# EAGLE design Proyecto (EAGLE 9.6.2)
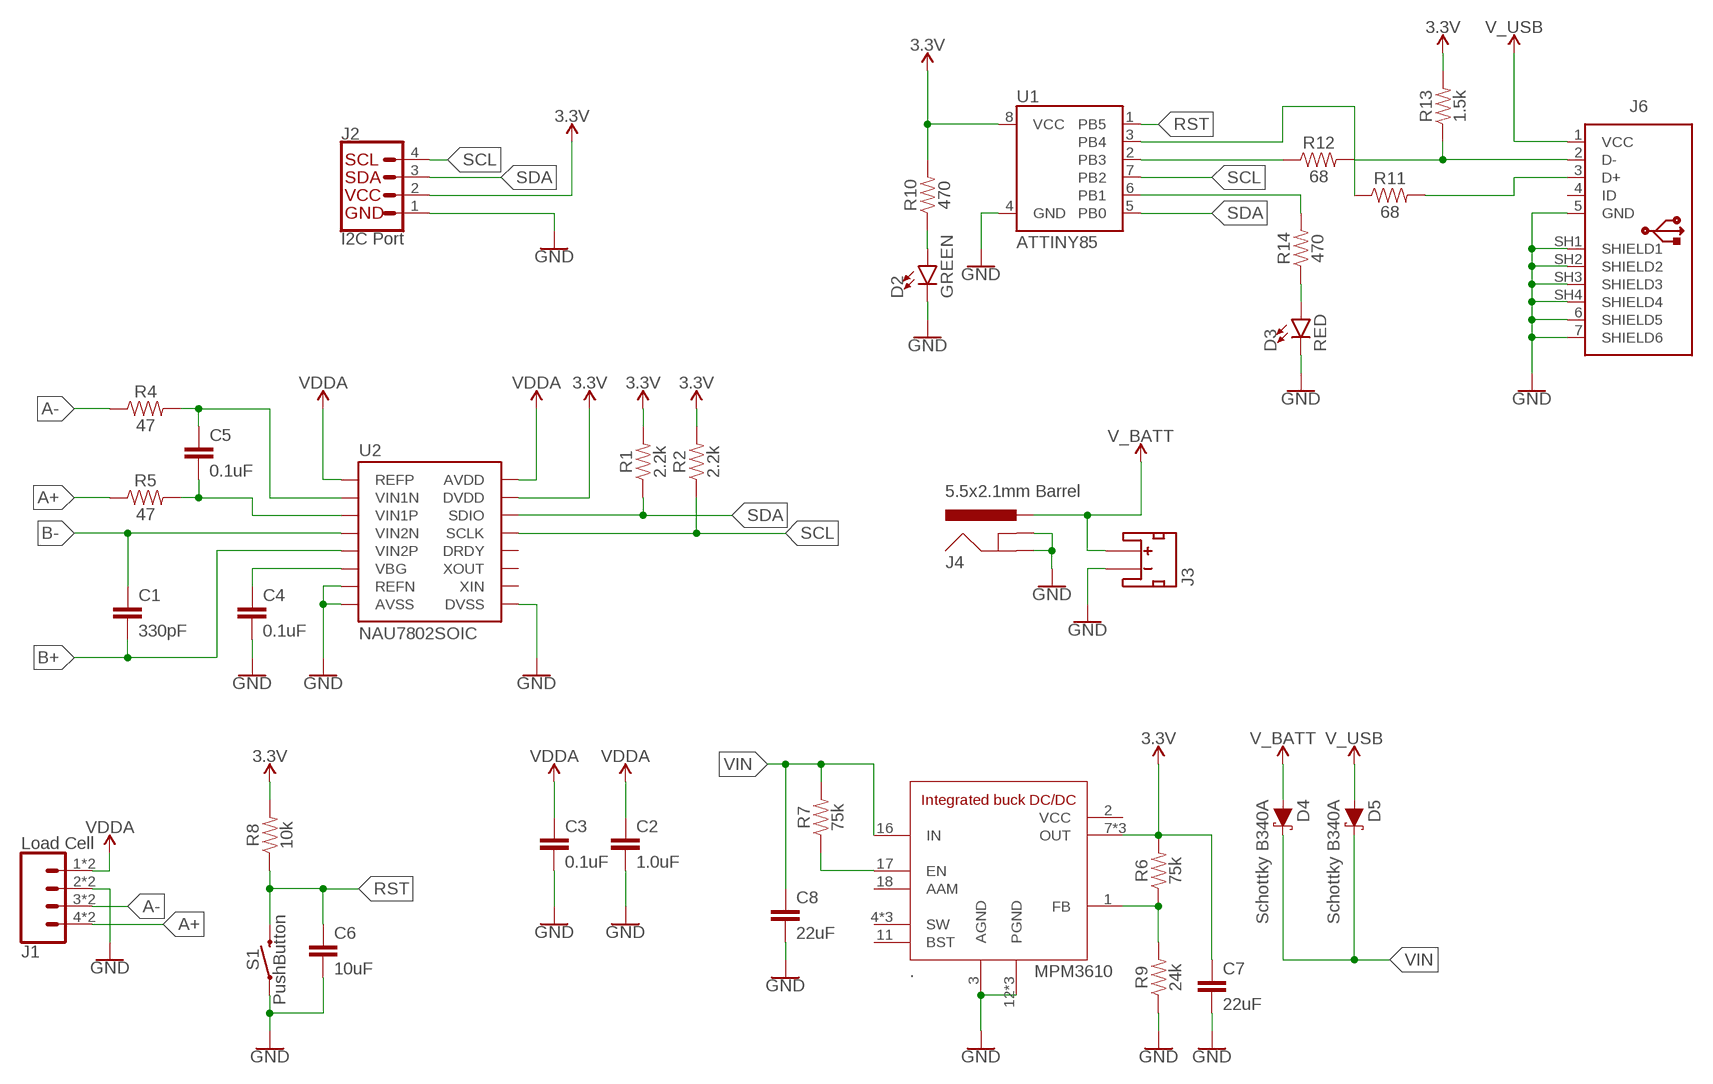
[diagram p0: schematic, sheet 1]

## Parts
.  MPM3610  MICROBUILDER_MPM3610  [MICROBUILDER_MPM3610]
C1  330pF  330PF-0603-50V-5%  [0603]
C2  1.0uF  1.0UF-0603-16V-10%  [0603]
C3  0.1uF  0.1UF-0603-25V-5%  [0603]
C4  0.1uF  0.1UF-0603-25V-5%  [0603]
C5  0.1uF  0.1UF-0603-25V-5%  [0603]
C6  10uF  10UF-0603-6.3V-20%  [0603]
C7  22uF  22UF-1206-50V-10%  [1206]
C8  22uF  22UF-1206-50V-10%  [1206]
D2  GREEN  LED-GREEN0603  [LED-0603]
D3  RED  LED-RED0603  [LED-0603]
D4  Schottky B340A  DIODE-SCHOTTKY-B340A  [SMA-DIODE]
D5  Schottky B340A  DIODE-SCHOTTKY-B340A  [SMA-DIODE]
J1  Load Cell  CONN_04SPRING  [1X04_SPRING_TERMINAL]
J2  I2C Port  QWIIC_CONNECTOR  [JST04_1MM_VERT]
J3  JST_2MM_MALE  [JST-2-SMD]
J4  5.5x2.1mm Barrel  POWER_JACKSMD  [POWER_JACK_SMD]
J6  10103594  [10103594]
R1  2.2k  2.2KOHM-0603-1/10W-1%  [0603]
R2  2.2k  2.2KOHM-0603-1/10W-1%  [0603]
R4  47  47OHM-0603-1/10W-1%  [0603]
R5  47  47OHM-0603-1/10W-1%  [0603]
R6  75k  75KOHM-0603-1/10W-1%  [0603]
R7  75k  75KOHM-0603-1/10W-1%  [0603]
R8  10k  10KOHM-0603-1/10W-1%  [0603]
R9  24k  20KOHM-0603-1/10W-1%  [0603]
R10  470  47OHM-0603-1/10W-1%  [0603]
R11  68  68OHM-0603-1/10W-1%  [0603]
R12  68  68OHM-0603-1/10W-1%  [0603]
R13  1.5k  1.5KOHM-0603-1/10W-1%  [0603]
R14  470  47OHM-0603-1/10W-1%  [0603]
S1  PushButton  MOMENTARY-SWITCH-SPST-SMD-5.2-TALL-REDUNDANT  [TACTILE_SWITCH_SMD_5.2MM]
U1  ATTINY85  [ATTINY85]
U2  NAU7802SOIC  [SO16]

## Nets
3.3V: ..7(OUT) ..8(OUT) ..9(OUT) C7.1 J2.2 R1.2 R2.2 R6.2 R8.2 R10.2 R13.2 U1.8(VCC) U2.15(DVDD)
A+: J1.4 J1.8 R5.1
A-: J1.3 J1.7 R4.1
B+: C1.2 U2.5(VIN2P)
B-: C1.1 U2.4(VIN2N)
GND: ..3(AGND) ..12(PGND) ..13(PGND) ..14(PGND) C2.2 C3.2 C4.2 C6.2 C7.2 C8.2 D2.C D3.C J1.2 J1.6 J2.1 J3.1(-) J4.GND(GNDBREAK) J4.P$4(GND) R9.1 S1.1 S1.2 U1.4(GND) U2.7(REFN) U2.8(AVSS) U2.9(DVSS)
N$1: R11.1 U1.3(PB4)
N$2: C4.1 U2.6(VBG)
N$3: ..1(FB) R6.1 R9.2
N$4: D3.A R14.1
N$5: C5.1 R4.2 U2.2(VIN1N)
N$6: C5.2 R5.2 U2.3(VIN1P)
N$7: ..17(EN) R7.1
N$8: R14.2 U1.6(PB1)
N$9: J6.3(D+) R11.2
N$10: R12.1 U1.2(PB3)
N$11: J6.2(D-) R12.2 R13.1
N$13: D2.A R10.1
RST: C6.1 R8.1 S1.3 S1.4 U1.1(PB5)
SCL: J2.4 R2.1 U1.7(PB2) U2.13(SCLK)
SDA: J2.3 R1.1 U1.5(PB0) U2.14(SDIO)
SHIELD5: J6.5(GND) J6.6(SHIELD5) J6.7(SHIELD6) J6.SH1(SHIELD1) J6.SH2(SHIELD2) J6.SH3(SHIELD3) J6.SH4(SHIELD4) ; supply symbol labelled GND
V_BATT: D4.A J3.2(+) J4.VIN0(PWR)
V_USB: D5.A J6.1(VCC)
VDDA: C2.1 C3.1 J1.1 J1.5 U2.1(REFP) U2.16(AVDD)
VIN: ..16(IN) C8.1 D4.C D5.C R7.2
Unconnected: ..4(SW) ..5(SW) ..6(SW) ..11(BST) ..18(AAM) J3.NC1(PAD1) J3.NC2(PAD2) J6.4(ID) U2.10(XIN) U2.11(XOUT) U2.12(DRDY)

## Power pins joined to a net without a drawn wire
VCC: ..2(VCC)

## Library data of the parts
. = Adafruit MPM3610:MICROBUILDER_MPM3610
C1 = SparkFun-Capacitors:330PF: 330pF/0.33nF ceramic capacitors A capacitor is a passive two-terminal electrical component used to store electrical energy temporarily in an electric field.; PROD_ID: CAP-10108
C2 = SparkFun-Capacitors:1.0UF: 1µF ceramic capacitors A capacitor is a passive two-terminal electrical component used to store electrical energy temporarily in an electric field.; PROD_ID: CAP-00868
C3-C5 = SparkFun-Capacitors:0.1UF: 0.1µF ceramic capacitors A capacitor is a passive two-terminal electrical component used to store electrical energy temporarily in an electric field.; PROD_ID: CAP-08604
C6 = SparkFun-Capacitors:10UF: 10.0µF ceramic capacitors A capacitor is a passive two-terminal electrical component used to store electrical energy temporarily in an electric field.; PROD_ID: CAP-11015
C7 C8 = SparkFun-Capacitors:22UF: 22µF ceramic capacitors A capacitor is a passive two-terminal electrical component used to store electrical energy temporarily in an electric field.; PROD_ID: CAP-15263
D2 = SparkFun-LED:LED-GREEN: Green SMD LED Used in manufacturing of various products at SparkFun Packages: 0603 - SMD 0603 package [Product Link] <http://www.futureelectronics.com/en/technologies/semiconductors/optoelectronics/leds/Pages/9894312-LTST-C190GKT.aspx?CrossPart=HSMG-C190&IM=0> LilyPad 1206 - SMD1206 LilyPad package [Product Link] <http://www.futureelectronics.com/en/Technologies/Product.aspx?ProductID=IN150NGHARVATEKCORPORATION2049943&IM=0> 1206 - SMD1206 package [Product Link] <http://www.futureelectronics.com/en/technologies/semiconductors/optoelectronics/leds/Pages/8315665-LTST-C150KGKT.aspx?IM=0> 1206 Bottom Mount -SMD 1206 Bottom Mount [Product Link] <http://www.digikey.com/product-detail/en/lite-on-inc/LTST-C230KGKT/160-1456-1-ND/386854> SparkFun Products: Pro Mini 328 -5V <https://www.sparkfun.com/products/821> RedBoard <https://www.sparkfun.com/products/12757> MP3 Trigger <https://www.sparkfun.com/products/13720> Makey Makey <https://www.sparkfun.com/products/11076>; PROD_ID: DIO-00821
D3 = SparkFun-LED:LED-RED: Red SMD LED Used in manufacturing of most products at SparkFun Packages: 0603 - SMD 0603 package [Product Link] <http://docs.avagotech.com/docs/AV02-0551EN> 0603 SMART - SMD 0603 SMART package ( more efficient and expensive)[Product Link] <http://www.osram-os.com/Graphics/XPic2/00077099_0.pdf> 1206 - SMD1206 package [Product Link] <https://www.sparkfun.com/datasheets/DevTools/LilyPad/Q150OVS4.pdff> SparkFun Products: Pro Mini 328 -5V <https://www.sparkfun.com/products/821> RedBoard <https://www.sparkfun.com/products/12757> IOIO-OTG <https://www.sparkfun.com/products/13613>; PROD_ID: DIO-00819
D4 D5 = SparkFun-DiscreteSemi:DIODE-SCHOTTKY: Schottky diode A Schottky diode is a semiconductor diode which has a low forward voltage drop and a very fast switching action.; PROD_ID: DIO-09886; VALUE: 3A/40V/500mV
J1 = SparkFun-Connectors:CONN_04: Multi connection point. Often used as Generic Header-pin footprint for 0.1 inch spaced/style header connections On any of the 0.1 inch spaced packages, you can populate with these: Break Away Headers - Straight <https://www.sparkfun.com/products/116> (PRT-00116) Break Away Male Headers - Right Angle <https://www.sparkfun.com/products/553> (PRT-00553) Female Headers <https://www.sparkfun.com/products/115> (PRT-00115) Break Away Headers - Machine Pin <https://www.sparkfun.com/products/117> (PRT-00117) Break Away Female Headers - Swiss Machine Pin <https://www.sparkfun.com/products/743> (PRT-00743) For SCREWTERMINALS and SPRING TERMINALS visit here: Screw Terimnals on SparkFun.com <https://www.sparkfun.com/search/results?term=Screw+Terminals> (5mm/3.5mm/2.54mm spacing) This device is also useful as a general connection point to wire up your design to another part of your project. Our various solder wires solder well into these plated through hole pads. Hook-Up Wire - Assortment (Stranded, 22 AWG) <https://www.sparkfun.com/products/11375> (PRT-11375) Hook-Up Wire - Assortment (Solid Core, 22 AWG) <https://www.sparkfun.com/products/11367> (PRT-11367) View the entire wire category on our website here <https://www.sparkfun.com/categories/141> Special notes: Molex polarized connector foot print use with SKU : PRT-08231 with associated crimp pins and housings. 1MM SMD Version SKU: PRT-10208; PROD_ID: CONN-14363; SF_ID: PRT-08075
J2 = SparkFun-Connectors:QWIIC_CONNECTOR: SparkFun I2C Standard Qwiic Connector An SMD 1mm pitch JST connector makes it easy and quick (get it? Qwiic?) to connect I2C devices to each other. The Qwiic system <http://www.sparkfun.com/qwiic> enables fast and solderless connection between popular platforms and various sensors and actuators. We carry 200mm <https://www.sparkfun.com/products/14204>, 100mm <https://www.sparkfun.com/products/14205>, 50mm <https://www.sparkfun.com/products/14206>, and breadboard friendly <https://www.sparkfun.com/products/14207> Qwiic cables. We also offer 10 pcs strips <https://www.sparkfun.com/products/14323> the SMD connectors.; PROD_ID: CONN-14483; VALUE: Vertical Qwiic Connector
J3 = SparkFun-Connectors:JST_2MM_MALE: JST 2MM MALE RA CONNECTOR Two pin, compact surface mount connector. Commonly used as a battery input connection point. We really like the solid locking feeling and high current rating on these small connectors. We use these all the time as battery connectors. Mates to single-cell LiPo batteries. Here is the connector we sell at SparkFun: JST Right Angle Connector - White <https://www.sparkfun.com/products/8612> (PRT-08612) Datasheet <http://www.sparkfun.com/datasheets/Prototyping/Connectors/JST-Horizontal.pdf> It was used on these SparkFun products: SparkFun MOSFET Power Controller <https://www.sparkfun.com/products/11214> (PRT-11214) SparkFun Battery Babysitter - LiPo Battery Manager <https://www.sparkfun.com/products/13777> (PRT-13777) And many, many others that required a lipo battery connection.; PROD_ID: CONN-11443; SF_ID: PRT-08612
J4 = SparkFun-Connectors:POWER_JACK: Power Jack Connector This is the standard 5.5mm barrel jack for power. The PTH is the most common, proven, reliable, footprint. The Slot footprint only works if the mill layer is transmitted to the PCB fab house so be warned. Here are the connectors we sell at SparkFun: DC Barrel Power Jack/Connector <https://www.sparkfun.com/products/119> (PRT-00119) DC Barrel Power Jack/Connector (SMD) <https://www.sparkfun.com/products/12748> (PRT-12748) DC Barrel Jack Adapter - Breadboard Compatible <https://www.sparkfun.com/products/10811> (PRT-10811) It is used on this SparkFun product (and many, many others): SparkFun RedBoard - Programmed with Arduino <https://www.sparkfun.com/products/12757> (DEV-12757) Also, if you need a mating power supply or connector, please check these out: Wall Adapter Power Supply - 9VDC 650mA <https://www.sparkfun.com/products/298> (TOL-00298) DC Barrel Jack Adapter - Male <https://www.sparkfun.com/products/10287> (PRT-10287); PROD_ID: CONN-08106; SF_ID: PRT-12748
J6 = Connector_USB:10103594: USB(2.0) Micro-B, RCPT, 5POS, SMD-THT-R/A Datasheet <https://cdn.amphenol-icc.com/media/wysiwyg/files/documentation/datasheet/inputoutput/io_usb_micro.pdf> Drawing <https://cdn.amphenol-icc.com/media/wysiwyg/files/drawing/10103594.pdf>; CATEGORY: Connectors; CONTACTS: 5; CURRENT-RATING: 1.8A; DESCRIPTION: CONN RCPT USB2.0 MICRO B SMD R/A; GENDER: Receptacle; MANUFACTURER: Amphenol ICC (FCI); MOUNT_TYPE: R/A; MPN: 10103594-0001LF; OPERATING_TEMPERATURE: -30°C ~ 80°C; PART_STATUS: ACTIVE; ROHS_COMPLIANT: COMPLIANT; SUB_CATEGORY: USB; TYPE: USB-micro B; VOLTAGE-RATING: 100VAC
R1 R2 = SparkFun-Resistors:2.2KOHM: 2.2kΩ resistor A resistor is a passive two-terminal electrical component that implements electrical resistance as a circuit element. Resistors act to reduce current flow, and, at the same time, act to lower voltage levels within circuits. - Wikipedia; PROD_ID: RES-08272
R4 R5 = SparkFun-Resistors:47OHM: 47Ω resistor A resistor is a passive two-terminal electrical component that implements electrical resistance as a circuit element. Resistors act to reduce current flow, and, at the same time, act to lower voltage levels within circuits. - Wikipedia; PROD_ID: RES-14282
R6 R7 = SparkFun-Resistors:75KOHM: 75kΩ resistor A resistor is a passive two-terminal electrical component that implements electrical resistance as a circuit element. Resistors act to reduce current flow, and, at the same time, act to lower voltage levels within circuits. - Wikipedia; PROD_ID: RES-09737
R8 = SparkFun-Resistors:10KOHM: 10kΩ resistor A resistor is a passive two-terminal electrical component that implements electrical resistance as a circuit element. Resistors act to reduce current flow, and, at the same time, act to lower voltage levels within circuits. - Wikipedia; PROD_ID: RES-00824
R9 = SparkFun-Resistors:20KOHM: 20kΩ resistor A resistor is a passive two-terminal electrical component that implements electrical resistance as a circuit element. Resistors act to reduce current flow, and, at the same time, act to lower voltage levels within circuits. - Wikipedia; PROD_ID: RES-09383; VALUE: 20k
R10 R14 = SparkFun-Resistors:47OHM: 47Ω resistor A resistor is a passive two-terminal electrical component that implements electrical resistance as a circuit element. Resistors act to reduce current flow, and, at the same time, act to lower voltage levels within circuits. - Wikipedia; PROD_ID: RES-14282; VALUE: 47
R11 R12 = SparkFun-Resistors:68OHM: 68Ω resistor A resistor is a passive two-terminal electrical component that implements electrical resistance as a circuit element. Resistors act to reduce current flow, and, at the same time, act to lower voltage levels within circuits. - Wikipedia
R13 = SparkFun-Resistors:1.5KOHM: 1.5kΩ resistor A resistor is a passive two-terminal electrical component that implements electrical resistance as a circuit element. Resistors act to reduce current flow, and, at the same time, act to lower voltage levels within circuits. - Wikipedia; PROD_ID: RES-08306
S1 = SparkFun-Switches:MOMENTARY-SWITCH-SPST: Momentary Switch (Pushbutton) - SPST Normally-open (NO) SPST momentary switches (buttons, pushbuttons). Variants PTH-12MM - 12mm square, through-hole Momentary Pushbutton Switch - 12mm Square <https://www.sparkfun.com/products/9190> (COM-09190) PTH-6.0MM, PTH-6.0MM-KIT - 6.0mm square, through-hole Mini Pushbutton Switch <https://www.sparkfun.com/products/97> (COM-00097) KIT package intended for soldering kit's - only one side of pads' copper is exposed. PTH-RIGHT-ANGLE-KIT - Right-angle, through-hole Right Angle Tactile Button <https://www.sparkfun.com/products/10791> - Used on SparkFun BigTime Watch Kit <https://www.sparkfun.com/products/11734> SMD-12MM - 12mm square, surface-mount Tactile Button - SMD (12mm) <https://www.sparkfun.com/products/12993> (COM-12993) Used on SparkFun PicoBoard <https://www.sparkfun.com/products/11888> SMD-4.5MM - 4.5mm Square Trackball Switch Used on SparkFun Blackberry Trackballer Breakout <https://www.sparkfun.com/products/13169> SMD-4.6MMX2.8MM - 4.60mm x 2.80mm, surface mount Used on SparkFun Pro Micro - RP2040 <https://www.sparkfun.com/products/17717> SMD-5.2MM, SMD-5.2-REDUNDANT - 5.2mm square, surface-mount Mini Pushbutton Switch - SMD <https://www.sparkfun.com/products/8720> (COM-08720) Used on Arduino Pro Mini <https://www.sparkfun.com/products/11114> REDUNDANT package connects both switch circuits together SMD-6.0X3.5MM - 6.0 x 3.5mm, surface mount Momentary Reset Switch SMD <https://www.sparkfun.com/products/8229> (COM-08229) SMD-6.2MM-TALL - 6.2mm square, surface mount Tactile Button - SMD (6mm) <https://www.sparkfun.com/products/12992> Used on SparkFun Digital Sandbox <https://www.sparkfun.com/products/12651> SMD-RIGHT-ANGLE - Right-angle, surface mount Used on SparkFun Block for Intel® Edison - Arduino <https://www.sparkfun.com/products/13036>; PROD_ID: SWCH-14139
U1 = SparkFun-IC-Microcontroller:ATTINY85; PROD_ID: IC-09092
U2 = SparkFun-IC-Conversion:NAU7802: 24-bit load cell conversion IC with I2C interface in SOIC-16 package. Similar to HX711 but with true I2C interface.; PROD_ID: IC-14299

## Net classes
0 Voltage: width 0.391 mm

## Board
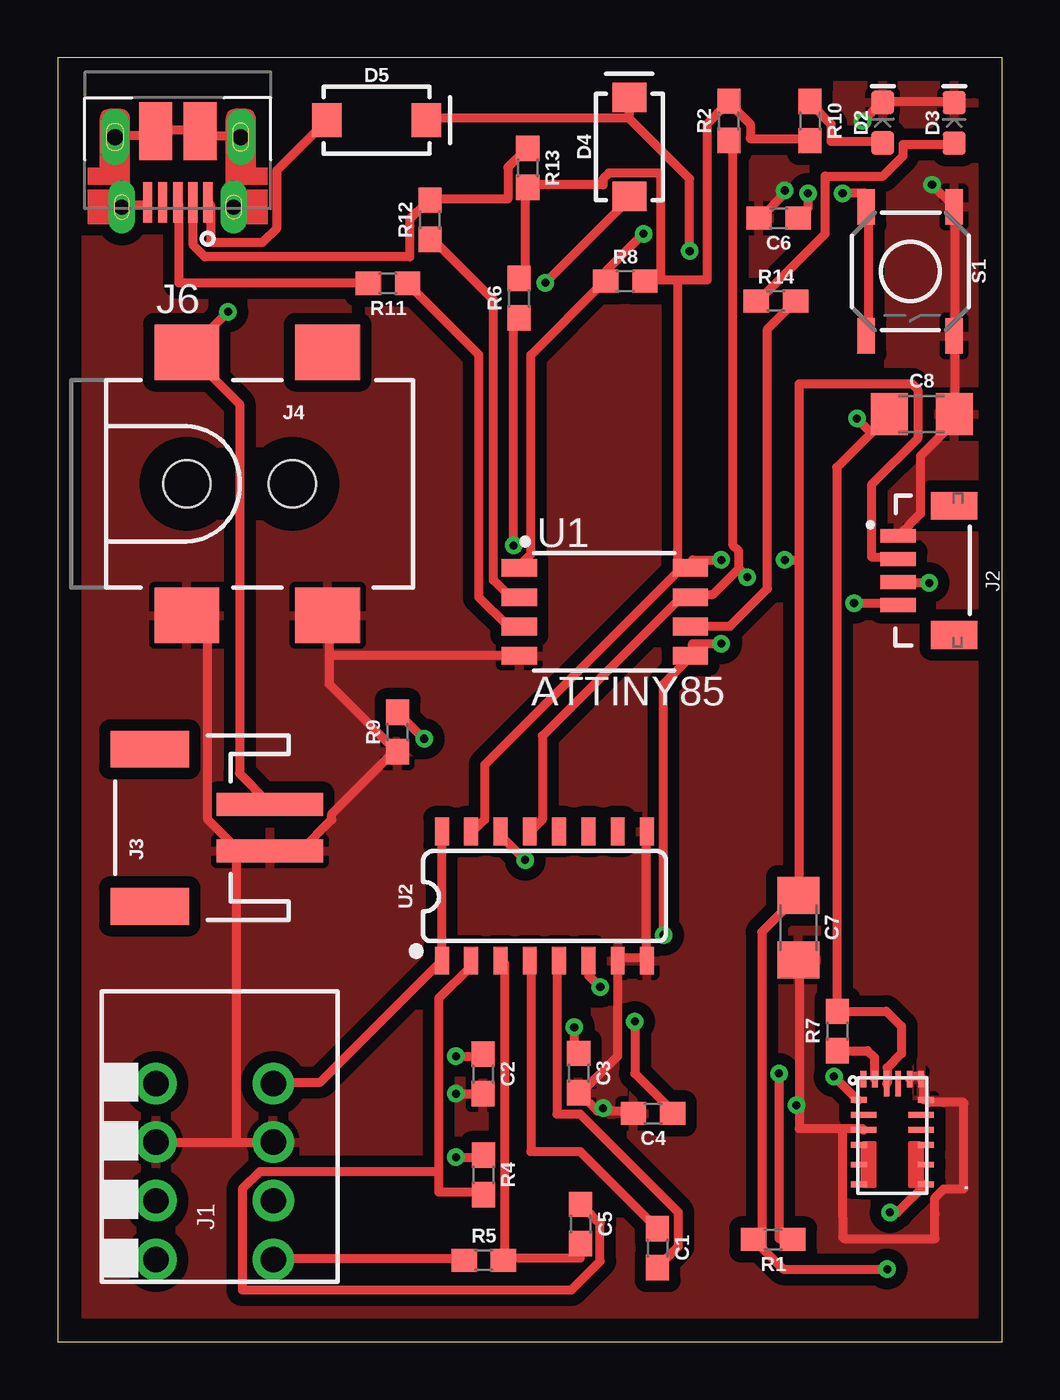
[diagram p1: board, top side]
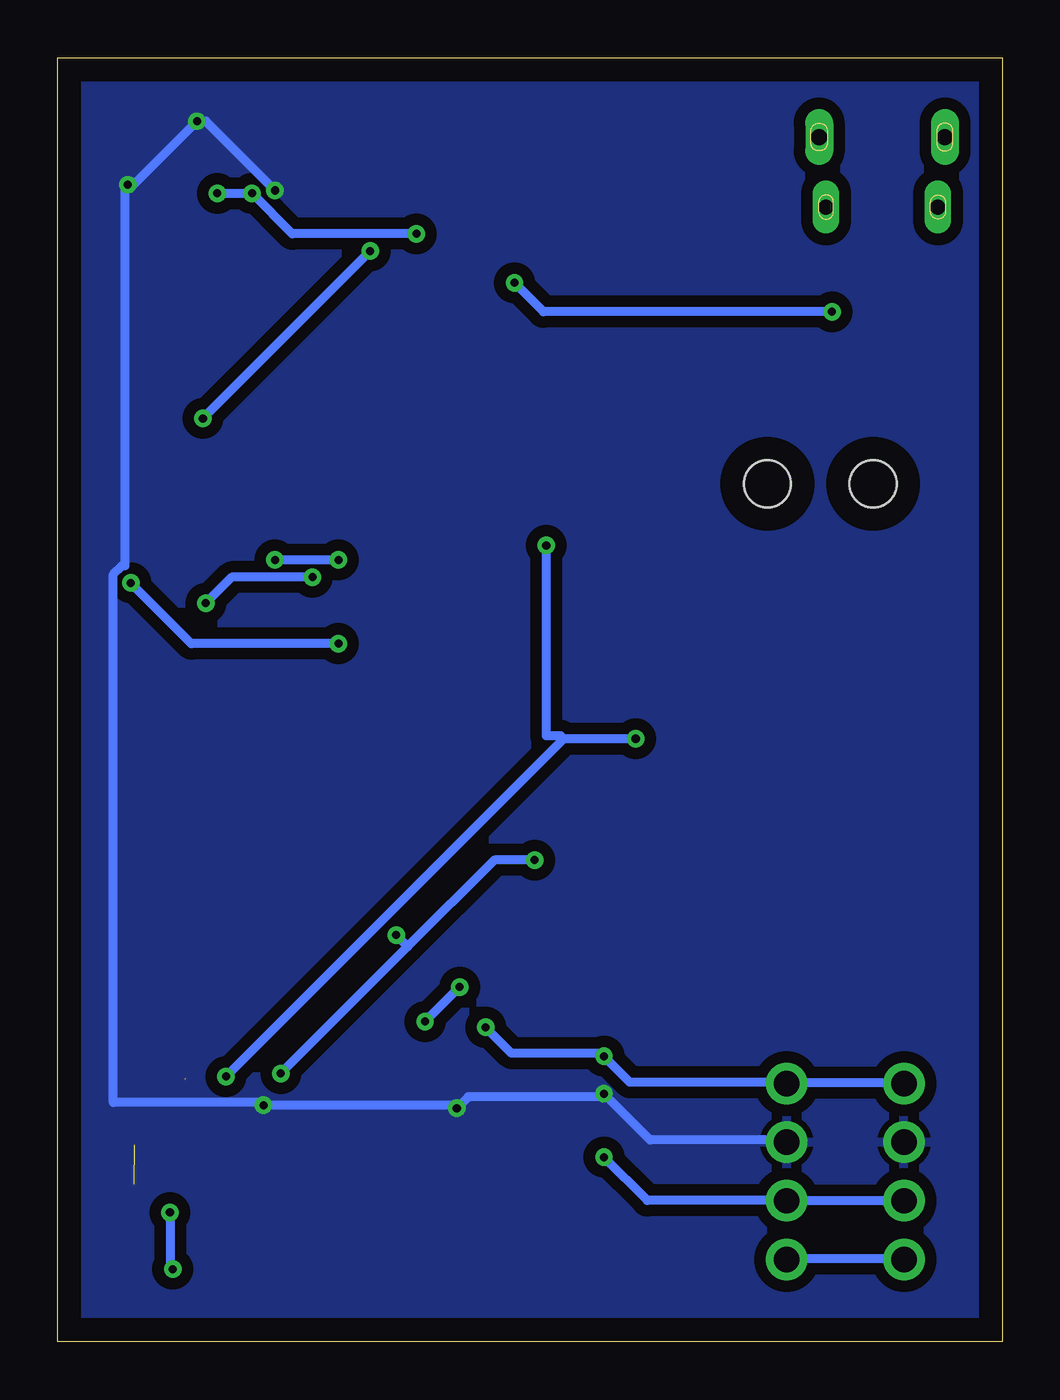
[diagram p2: board, bottom side, seen from below]

Size 40.91 x 55.62 mm. Coordinates in mm from the lower left corner, seen from the top.
Outline: 0,0 40.91,0 40.91,55.62 0,55.62 0,0
Copper layers (1*16): Top 0.035mm / dielectric 1.5mm / Bottom 0.035mm
Design rules "default": minimum track width 6mil, minimum drill 0.35mm, track to track 6mil, track to pad 6mil, pad to pad 6mil, via to via 6mil, smd to smd 6mil, copper to edge 40mil, drill to drill 6mil, minimum pad ring 10mil, minimum via ring 8mil, stop-mask expansion 4mil, vias tented up to drill 0mil, thermal gap 10mil

### Footprints (pad centres in the part's own frame; a part is rotated, then mirrored left to right if it is on the bottom)
MICROBUILDER_MPM3610 = smd 0.7 x 0.25: 1 -1.45,1.55; 4 -1.45,-0.4; 5 -1.45,-1.25; 6 -1.45,-2.1; 7 1.45,-2.1; 8 1.45,-1.25; 9 1.45,-0.4; 12 1.45,1.55 | smd 1.1 x 0.25: 2 -1.25,0.9; 3 -1.25,0.25; 10 1.25,0.25; 11 1.25,0.9 | smd 0.25 x 0.7: 13 1.25,2.45; 14 0.75,2.45; 17 -0.75,2.45; 18 -1.25,2.45 | smd 0.25 x 1.1: 15 0.25,2.25; 16 -0.25,2.25
0603 = smd 1.1 x 1: 1 -0.85,0; 2 0.85,0
1206 = smd 1.6 x 1.8: 1 -1.4,0; 2 1.4,0
LED-0603 = smd 1 x 1: A -0.877,0; C 0.877,0
SMA-DIODE = smd 1.27 x 1.47: A -2.15,0; C 2.15,0
1X04_SPRING_TERMINAL = drill 1.1 pad 1.8: 1 7.62,2.54; 2 5.08,2.54; 3 2.54,2.54; 4 0,2.54; 5 7.62,-2.54; 6 5.08,-2.54; 7 2.54,-2.54; 8 0,-2.54
JST04_1MM_VERT = smd 0.6 x 1.55: 1 -1.478,0.775; 2 -0.478,0.775; 3 0.522,0.775; 4 1.522,0.775 | smd 1.2 x 2: NC1 -2.778,3.2; NC2 2.822,3.2
JST-2-SMD = smd 1 x 4.6: 1 -1,-3.7; 2 1,-3.7 | smd 1.6 x 3.4: NC1 -3.4,1.5; NC2 3.4,1.5
POWER_JACK_SMD = smd 2.8 x 2.4: GND 0,-5.7; P$4 6.1,-5.7; VIN0 0,5.7; VIN1 6.1,5.7 | hole 2.032: 0,0; 4.572,0
10103594 = smd 0.4 x 1.75: 1 -1.3,2.825; 2 -0.65,2.825; 3 0,2.825; 4 0.65,2.825; 5 1.3,2.825 | smd 1.425 x 2.5: 6 -0.963,-0.25; 7 0.963,-0.25 | drill 0.65 pad 0.73 long: SH1 -2.425,3.03; SH2 2.425,3.03 | drill 0.7 long: SH3 -2.725,0; SH4 2.725,0
TACTILE_SWITCH_SMD_5.2MM = smd 1.524 x 0.762: 1 -2.794,1.905; 2 2.794,1.905; 3 -2.794,-1.905; 4 2.794,-1.905
ATTINY85 = smd 1.524 x 0.762: 1 -3.683,1.905; 2 -3.683,0.635; 3 -3.683,-0.635; 4 -3.683,-1.905; 5 3.727,-1.905; 6 3.727,-0.635; 7 3.727,0.635; 8 3.727,1.905
SO16 = smd 0.6 x 1.2: 1 -4.445,-2.8; 2 -3.175,-2.8; 3 -1.905,-2.8; 4 -0.635,-2.8; 5 0.635,-2.8; 6 1.905,-2.8; 7 3.175,-2.8; 8 4.445,-2.8; 9 4.445,2.8; 10 3.175,2.8; 11 1.905,2.8; 12 0.635,2.8; 13 -0.635,2.8; 14 -1.905,2.8; 15 -3.175,2.8; 16 -4.445,2.8

### Placement (x,y rotation side)
.  36.15,8.93 0 top
C1  25.98,4.06 270 top
C2  18.43,11.6 270 top
C3  22.57,11.64 270 top
C4  25.79,9.89 180 top
C5  22.65,5.11 270 top
C6  31.23,48.67 180 top
C7  32.09,17.94 270 top
C8  37.43,40.18 0 top
D2  35.73,52.8 90 top
D3  38.84,52.8 90 top
D4  24.76,51.75 90 top
D5  13.81,52.91 0 top
J1  6.8,3.57 90 top
J2  35.63,33.43 270 top
J3  5.49,22.27 90 top
J4  5.59,37.16 0 top
J6  5.2,52.18 180 top
R1  30.99,4.43 180 top
R2  29.07,52.89 90 top
R4  18.44,7.23 270 top
R5  18.46,3.53 0 top
R6  19.99,45.2 90 top
R7  33.78,13.46 90 top
R8  24.59,45.94 0 top
R9  14.73,26.41 90 top
R10  32.59,52.87 270 top
R11  14.31,45.84 180 top
R12  16.13,48.6 90 top
R13  20.36,50.85 270 top
R14  31.11,45.07 0 top
S1  36.93,46.36 270 top
U1  23.68,31.62 0 top
U2  21.09,19.31 0 top

### Tracks (layer width: path | path; a pad name or v marks a point on that pad's centre or on a via)
3.3V  (via drill 0.35)  (2 unrouted)
  Top 0.391: 32.12,33.87 32.12,19.49 C7.1 32,19.24 30.5,17.74 30.5,4.46 R1.2 31.43,3.14 v35.93,3.14 | 32.12,33.87 32.12,41.49 37,41.49 37.25,41.24 37.25,39.12 35.25,37.12 35.25,33.99 36.38,33.99 J2.2 | R6.2 20,46.12 20.25,46.37 20.25,49.99 R13.2 20.5,50.12 23.62,50.12 23.62,50.37 23.88,50.62 26.12,50.62 26.12,45.99 | 26.88,45.99 28.12,45.99 28.12,52.74 29,53.62 R2.2 29.12,53.62 30,52.74 30,52.12 32.5,52.12 R10.2 | 26.88,45.99 26.12,45.99 | 26.12,45.99 25.5,45.99 R8.2 | U2.15 18,22.12 18.5,22.62 18.5,24.99 27,33.49 27.38,33.49 U1.8 | 26.88,45.99 26.88,33.62 U1.8 | v31.5,33.87 32.12,33.87 | v28.75,33.87 27.5,33.87 27.5,33.62 U1.8 | ..7 36.38,5.6 v36.05,5.6
  Bottom 0.391: v28.75,33.87 v31.5,33.87 | v36.05,5.6 36.05,3.26 v35.93,3.14
A+
  Top 0.391: R5.1 17.5,3.62 9.38,3.62 J1.8
  Bottom 0.391: J1.4 4.38,3.62 9.25,3.62 J1.8
A-  (via drill 0.35)
  Top 0.391: v17.25,7.99 18.38,7.99 R4.1
  Bottom 0.391: v17.25,7.99 15.38,6.12 9.38,6.12 J1.7 9.25,6.12 4.38,6.12 J1.3
B+
  Top 0.391: C1.2 26,3.24 26.88,4.12 26.88,5.62 22.62,9.87 21.62,9.87 21.62,16.49 U2.5
B-
  Top 0.391: C1.1 25.88,4.99 22.62,8.24 20.5,8.24 20.5,16.49 U2.4
GND  (via drill 0.35)
  Top 0.391: 11.75,29.74 11.75,31.37 J4.P$4 | 11.75,29.74 11.75,28.49 14.62,25.62 R9.1 14.5,25.49 11.88,22.87 11.88,22.62 10.5,21.24 9.38,21.24 J3.1 | 11.75,29.74 19.88,29.74 U1.4 | J4.GND 5.62,31.37 6.5,30.49 6.5,22.62 7.75,21.37 9.12,21.37 J3.1 | D3.C 38.75,53.74 35.75,53.74 D2.C 35.62,53.62 v34.88,52.87 | v31.5,49.87 31.5,49.74 30.5,48.74 C6.2 | J2.1 36.5,34.99 37.38,35.87 37.38,38.37 38.88,39.87 38.88,39.99 C8.2 38.88,40.24 38.88,43.49 S1.2 38.88,43.74 38.88,49.12 S1.1 38.75,49.24 v37.88,50.12 | ..14 37,11.49 37.38,11.49 ..13 37.5,11.24 37.5,10.49 ..12 37.75,10.37 38.38,10.37 39.24,10.36 39.26,10.35 39.26,6.66 39.22,6.62 38.38,6.62 38,6.24 38,5.53 | 34,9.24 32.12,9.24 32.12,10.24 | 34,9.24 34.88,9.24 ..3 | 32.12,10.24 32.12,16.49 C7.2 | 38,5.53 38,4.47 37.99,4.46 34.07,4.46 34.01,4.53 34,6.24 34,9.24 | 23.62,9.99 23.38,9.99 22.62,10.74 C3.2 22.75,10.87 24.25,12.37 24.25,16.37 U2.7 24.38,16.62 25.5,16.62 U2.8 25.5,16.74 25.5,21.99 U2.9 | 23.62,9.99 24.88,9.99 C4.2 | v17.25,10.74 18.38,10.74 C2.2 | 7.75,8.62 9.25,8.62 J1.6 | 7.75,8.62 4.38,8.62 J1.2 | v23.62,10.12 23.62,9.99 | v32,10.24 32.12,10.24 | 7.75,8.62 7.75,21.24 J3.1 | 38,5.53
  Bottom 0.391: v31.5,49.87 34.5,52.87 v34.88,52.87 37.62,50.12 v37.88,50.12 38,49.99 38,33.62 38.12,33.62 38.5,33.24 38.5,10.37 32.12,10.37 v32,10.24 23.75,10.24 v23.62,10.12 23.12,10.62 17.38,10.62 v17.25,10.74 15.25,8.74 9.38,8.74 J1.6
  pour Bottom (isolate 0.5): 0,55.62 41,55.62 41,-0.38 0,-0.38
  pour Top (isolate 0.5): 0,55.62 41,55.62 41,-0.38 0,-0.38
N$1
  Top 0.391: R11.1 15.25,45.74 18.25,42.74 18.25,32.24 19.5,30.99 19.88,30.99 U1.3
N$2  (via drill 0.35)
  Top 0.391: v25,13.87 25,11.62 26.62,9.99 C4.1 | v23.5,15.37 23,15.87 23,16.49 U2.6
  Bottom 0.391: v23.5,15.37 v25,13.87
N$3  (via drill 0.35)
  Top 0.391: v33.62,11.49 34.62,10.49 ..1 | v15.88,26.12 14.75,27.24 R9.2 | v19.75,34.49 19.75,44.12 19.88,44.24 R6.1
  Bottom 0.391: 19,26.12 v33.62,11.49 | v15.88,26.12 19,26.12 | v19.75,34.49 19.75,26.24 19.12,26.24 19,26.12
N$4
  Top 0.391: D3.A 38.75,51.87 36.62,51.87 36.62,51.37 35.75,50.49 33.25,50.49 33.25,47.99 30.38,45.12 R14.1
N$5
  Top 0.391: 16.5,7.37 16.5,14.87 17.88,16.24 17.88,16.49 U2.2 | 16.5,7.37 16.5,6.49 18.38,6.49 R4.2 | 16.5,7.37 8.75,7.37 8,6.62 8,2.24 22.25,2.24 23.5,3.49 23.5,5.12 22.75,5.87 C5.1
N$6
  Top 0.391: C5.2 22.62,4.24 22.62,3.62 19.38,3.62 R5.2 19.38,3.74 19.38,16.37 19.25,16.49 U2.3
N$7  (1 unrouted)
  Top 0.391: R7.1 35.08,12.61 35.38,12.31 35.38,11.42
N$8
  Top 0.391: R14.2 31.88,44.99 30.75,43.87 30.75,32.62 29.12,30.99 27.5,30.99 U1.6
N$9
  Top 0.391: R11.2 13.38,45.87 5.25,45.87 5.25,49.24 J6.3
N$10
  Top 0.391: R12.1 16.25,47.74 18.88,45.12 18.88,32.99 19.5,32.37 19.88,32.37 U1.2
N$11
  Top 0.391: R13.1 20.25,51.62 19.5,50.87 19.5,49.49 16.25,49.49 R12.2 16,49.37 15.25,48.62 15.25,46.99 6.38,46.99 5.88,47.49 5.88,49.24 J6.2
N$13
  Top 0.391: D2.A 35.62,51.99 33.5,51.99 33.5,52.74 32.62,53.62 R10.1
RST  (via drill 0.35)
  Top 0.391: v32.5,49.74 32.5,49.12 32.12,48.74 C6.1 | v34,49.74 35,49.74 35,49.24 S1.3 35.12,48.99 35.12,43.62 S1.4 | U1.1 20,33.62 20.5,34.12 20.5,42.74 23.62,45.87 R8.1 23.75,46.12 23.75,46.37 v25.38,47.99
  Bottom 0.391: v34,49.74 v32.5,49.74 30.75,47.99 v25.38,47.99
SCL  (via drill 0.35)
  Top 0.391: 29.5,33.49 29.5,34.24 29.25,34.49 29.25,51.87 29.12,51.99 R2.1 | 29.5,33.49 28.38,32.37 27.5,32.37 U1.7 27.25,32.24 27,32.24 21,26.24 21,22.62 20.5,22.12 U2.13 | v34.5,31.99 36.38,31.99 J2.4 | 29.5,33.49 v29.88,33.12
  Bottom 0.391: v34.5,31.99 33.38,33.12 v29.88,33.12
SDA  (via drill 0.35)
  Top 0.391: v31.25,11.62 31.25,4.47 R1.1 | v20.25,20.87 19.25,21.87 19.25,21.99 U2.14 | v26.25,17.62 26.25,28.49 27.38,29.62 U1.5 27.5,29.87 27.5,30.24 v28.75,30.24 | v37.75,32.87 36.5,32.87 J2.3
  Bottom 0.391: 25.75,17.12 22,20.87 v20.25,20.87 | 25.75,17.12 v31.25,11.62 | 25.75,17.12 v26.25,17.62 | v37.75,32.87 35.12,30.24 v28.75,30.24
SHIELD5
  Top 0.391: J6.SH1 7.75,49.24 7.88,49.37 7.88,52.12 J6.SH3 7.75,52.24 6.25,52.24 6.25,52.37 J6.6 6,52.49 4.38,52.49 J6.7 4.12,52.37 4.12,52.24 2.62,52.24 J6.SH4 2.5,52.12 2.5,49.62 2.75,49.37 J6.SH2 2.88,49.24 3.88,49.24 J6.5
V_BATT  (via drill 0.35)
  Top 0.391: v21.12,45.87 24.75,49.49 D4.A | v7.38,44.62 5.62,42.87 J4.VIN0 5.75,42.74 7.88,40.62 7.88,24.62 9.12,23.37 J3.2
  Bottom 0.391: v21.12,45.87 19.88,44.62 v7.38,44.62
V_USB
  Top 0.391: D5.A 11.62,52.87 9.5,50.74 9.5,48.24 8.88,47.62 6.62,47.62 6.62,49.24 J6.1
VDDA  (via drill 0.35)
  Top 0.391: U2.16 16.62,21.99 16.62,16.62 U2.1 16.5,16.37 11.38,11.24 9.38,11.24 J1.5 | v17.25,12.37 18.38,12.37 C2.1 | v22.38,13.62 22.38,12.62 22.5,12.49 C3.1
  Bottom 0.391: v22.38,13.62 21.25,12.49 17.38,12.49 v17.25,12.37 16.12,11.24 9.38,11.24 J1.5 9.25,11.24 4.38,11.24 J1.1
VIN  (via drill 0.35)
  Top 0.391: 24.75,52.99 16,52.99 D5.C | 24.75,52.99 24.75,53.87 D4.C | 35.25,39.37 36,40.12 C8.1 | 35.25,39.37 33.75,37.87 33.75,14.37 R7.2 35.89,14.31 35.89,14.32 | 24.75,52.99 27.38,50.37 v27.38,47.24 | 35.25,39.37 v34.62,39.99 | 35.89,14.32 | 35.89,14.32 36.55,13.66 36.55,12.49 35.93,11.87 35.93,11.2 ..16
  Bottom 0.391: v34.62,39.99 v27.38,47.24